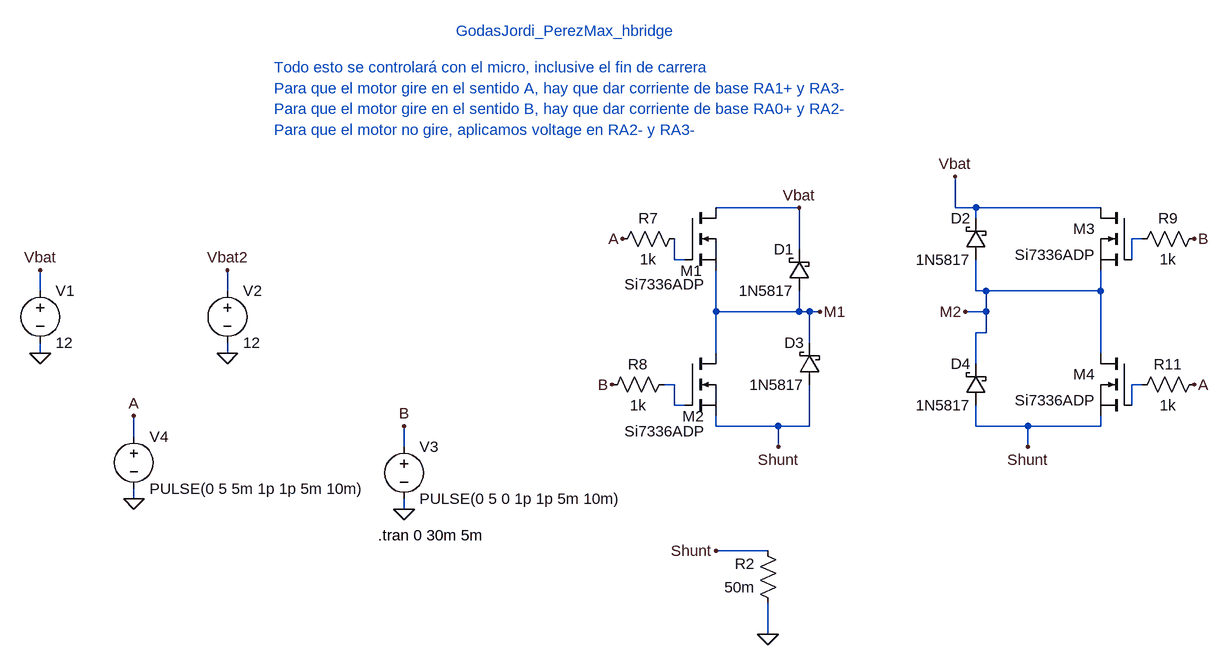
[diagram p0: schematic h_bridge.asc]
h_bridge.asc, the LTspice schematic file:
Version 4
SHEET 1 2112 680
WIRE 1008 -272 880 -272
WIRE 1248 -272 1248 -320
WIRE 1280 -272 1248 -272
WIRE 1472 -272 1280 -272
WIRE 1280 -256 1280 -272
WIRE 1536 -224 1520 -224
WIRE 1008 -208 1008 -272
WIRE 816 -192 816 -224
WIRE 832 -192 816 -192
WIRE 1520 -192 1520 -224
WIRE -160 -144 -160 -176
WIRE 128 -144 128 -176
WIRE 1280 -144 1280 -192
WIRE 1296 -144 1280 -144
WIRE 1472 -144 1472 -176
WIRE 1472 -144 1296 -144
WIRE 880 -112 880 -176
WIRE 1008 -112 1008 -144
WIRE 1008 -112 880 -112
WIRE 1024 -112 1008 -112
WIRE 1040 -112 1024 -112
WIRE 1296 -112 1296 -144
WIRE 1296 -112 1264 -112
WIRE 1296 -80 1296 -112
WIRE 1296 -80 1280 -80
WIRE 1024 -64 1024 -112
WIRE -160 -48 -160 -64
WIRE 128 -48 128 -64
WIRE 880 -48 880 -112
WIRE 1472 -48 1472 -144
WIRE 1280 -32 1280 -80
WIRE 816 0 800 0
WIRE 1536 0 1520 0
WIRE 816 32 816 0
WIRE 832 32 816 32
WIRE 1520 32 1520 0
WIRE 880 64 880 48
WIRE 976 64 880 64
WIRE 1024 64 1024 0
WIRE 1024 64 976 64
WIRE 1280 64 1280 32
WIRE 1360 64 1280 64
WIRE 1472 64 1472 48
WIRE 1472 64 1360 64
WIRE -16 80 -16 48
WIRE 400 96 400 64
WIRE 976 96 976 64
WIRE 1360 96 1360 64
WIRE -16 176 -16 160
WIRE 400 192 400 176
WIRE 960 256 880 256
WIRE 960 384 960 336
FLAG 1248 -320 Vbat
FLAG -160 -48 0
FLAG -160 -176 Vbat
FLAG 400 192 0
FLAG 400 64 B
FLAG -16 176 0
FLAG -16 48 A
FLAG 960 384 0
FLAG 880 256 Shunt
FLAG 736 -224 A
FLAG 1616 0 A
FLAG 720 0 B
FLAG 1616 -224 B
FLAG 1008 -272 Vbat
FLAG 128 -48 0
FLAG 128 -176 Vbat2
FLAG 976 96 Shunt
FLAG 1360 96 Shunt
FLAG 1040 -112 M1
FLAG 1264 -112 M2
SYMBOL voltage -160 -160 R0
WINDOW 123 0 0 Left 0
WINDOW 39 0 0 Left 0
SYMATTR InstName V1
SYMATTR Value 12
SYMBOL voltage 400 80 R0
WINDOW 123 0 0 Left 0
WINDOW 39 0 0 Left 0
SYMATTR InstName V3
SYMATTR Value PULSE(0 5 0 1p 1p 5m 10m)
SYMBOL voltage -16 64 R0
WINDOW 123 0 0 Left 0
WINDOW 39 0 0 Left 0
SYMATTR InstName V4
SYMATTR Value PULSE(0 5 5m 1p 1p 5m 10m)
SYMBOL res 976 352 R180
WINDOW 0 36 76 Left 2
WINDOW 3 36 40 Left 2
SYMATTR InstName R2
SYMATTR Value 50m
SYMBOL res 832 -240 R90
WINDOW 0 0 56 VBottom 2
WINDOW 3 32 56 VTop 2
SYMATTR InstName R7
SYMATTR Value 1k
SYMBOL res 816 -16 R90
WINDOW 0 0 56 VBottom 2
WINDOW 3 32 56 VTop 2
SYMATTR InstName R8
SYMATTR Value 1k
SYMBOL res 1632 -240 R90
WINDOW 0 0 56 VBottom 2
WINDOW 3 32 56 VTop 2
SYMATTR InstName R9
SYMATTR Value 1k
SYMBOL res 1632 -16 R90
WINDOW 0 0 56 VBottom 2
WINDOW 3 32 56 VTop 2
SYMATTR InstName R11
SYMATTR Value 1k
SYMBOL schottky 1024 -144 R180
WINDOW 0 24 64 Left 2
WINDOW 3 24 0 Left 2
SYMATTR InstName D1
SYMATTR Value 1N5817
SYMBOL schottky 1296 -192 R180
WINDOW 0 24 64 Left 2
WINDOW 3 24 0 Left 2
SYMATTR InstName D2
SYMATTR Value 1N5817
SYMBOL schottky 1040 0 R180
WINDOW 0 24 64 Left 2
WINDOW 3 24 0 Left 2
SYMATTR InstName D3
SYMATTR Value 1N5817
SYMBOL schottky 1296 32 R180
WINDOW 0 24 64 Left 2
WINDOW 3 24 0 Left 2
SYMATTR InstName D4
SYMATTR Value 1N5817
SYMBOL nmos 832 -272 R0
WINDOW 0 -7 97 Left 2
WINDOW 3 -93 118 Left 2
SYMATTR InstName M1
SYMATTR Value Si7336ADP
SYMBOL nmos 1520 -272 M0
SYMATTR InstName M3
SYMATTR Value Si7336ADP
SYMBOL voltage 128 -160 R0
WINDOW 123 0 0 Left 0
WINDOW 39 0 0 Left 0
SYMATTR InstName V2
SYMATTR Value 12
SYMBOL nmos 832 -48 R0
WINDOW 0 -4 97 Left 2
WINDOW 3 -93 120 Left 2
SYMATTR InstName M2
SYMATTR Value Si7336ADP
SYMBOL nmos 1520 -48 M0
SYMATTR InstName M4
SYMATTR Value Si7336ADP
TEXT 360 232 Left 2 !.tran 0 30m 5m
TEXT 480 -544 Left 2 ;GodasJordi_PerezMax_hbridge
TEXT 200 -456 Left 2 ;Para que el motor gire en el sentido A, hay que dar corriente de base RA1+ y RA3-
TEXT 200 -424 Left 2 ;Para que el motor gire en el sentido B, hay que dar corriente de base RA0+ y RA2-
TEXT 200 -488 Left 2 ;Todo esto se controlará con el micro, inclusive el fin de carrera
TEXT 200 -392 Left 2 ;Para que el motor no gire, aplicamos voltage en RA2- y RA3-

The netlist it stands for:
* h_bridge.asc
V1 Vbat 0 12
V3 B 0 PULSE(0 5 0 1p 1p 5m 10m)
V4 A 0 PULSE(0 5 5m 1p 1p 5m 10m)
R2 0 Shunt 50m
R7 N002 A 1k
R8 N003 B 1k
R9 B N001 1k
R11 A N004 1k
D1 M1 Vbat 1N5817
D2 M2 Vbat 1N5817
D3 Shunt M1 1N5817
D4 Shunt M2 1N5817
M1 Vbat N002 M1 M1 Si7336ADP
M3 Vbat N001 M2 M2 Si7336ADP
V2 Vbat2 0 12
M2 M1 N003 Shunt Shunt Si7336ADP
M4 M2 N004 Shunt Shunt Si7336ADP
.model D D
.lib standard.dio
.model NMOS NMOS
.model PMOS PMOS
.lib standard.mos
.tran 0 30m 5m
* GodasJordi_PerezMax_hbridge
* Para que el motor gire en el sentido A, hay que dar corriente de base RA1+ y RA3-
* Para que el motor gire en el sentido B, hay que dar corriente de base RA0+ y RA2-
* Todo esto se controlará con el micro, inclusive el fin de carrera
* Para que el motor no gire, aplicamos voltage en RA2- y RA3-
.backanno
.end